# EAGLE design navscreen_piboard_r0 (EAGLE 6.5.0)
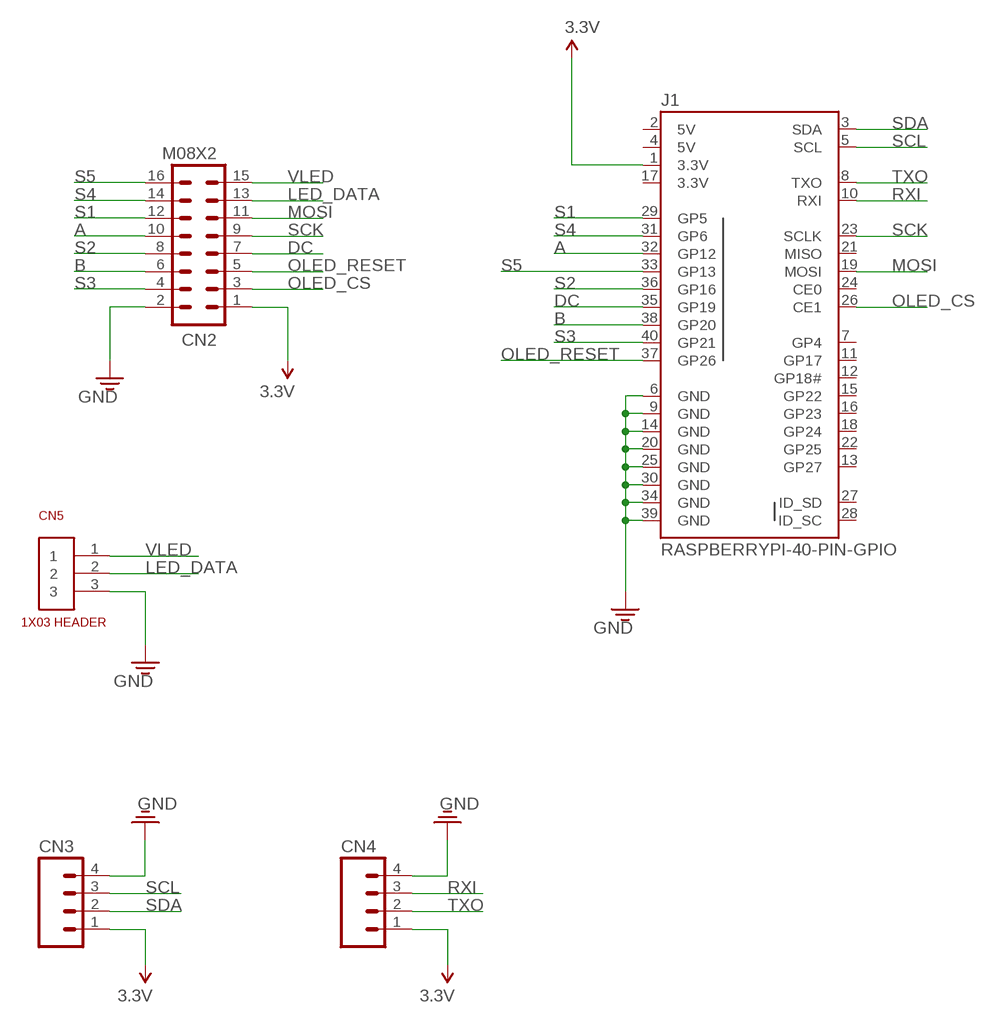
[diagram p0: schematic, sheet 1]

## Parts
CN2  M08X2  [2X8]
CN3  M04PTH  [1X04]
CN4  M04PTH  [1X04]
CN5  1X03  [1X03]
J1  RASPBERRYPI-40-PIN-GPIO  [2X20-SHROUDED]

## Nets
3.3V: CN2.1 CN3.1 CN4.1 J1.1(3.3V)
A: CN2.10 J1.32(GP12)
B: CN2.6 J1.38(GP20)
DC: CN2.7 J1.35(GP19)
GND: CN2.2 CN3.4 CN4.4 CN5.3 J1.6(GND) J1.9(GND) J1.14(GND) J1.20(GND) J1.25(GND) J1.30(GND) J1.34(GND) J1.39(GND)
LED_DATA: CN2.13 CN5.2
MOSI: CN2.11 J1.19(MOSI)
OLED_CS: CN2.3 J1.26(CE1)
OLED_RESET: CN2.5 J1.37(GP26)
RXI: CN4.3 J1.10(RXI)
S1: CN2.12 J1.29(GP5)
S2: CN2.8 J1.36(GP16)
S3: CN2.4 J1.40(GP21)
S4: CN2.14 J1.31(GP6)
S5: CN2.16 J1.33(GP13)
SCK: CN2.9 J1.23(SCLK)
SCL: CN3.3 J1.5(SCL)
SDA: CN3.2 J1.3(SDA)
TXO: CN4.2 J1.8(TXO)
VLED: CN2.15 CN5.1
Unconnected: J1.7(GP4) J1.11(GP17) J1.12(GP18#) J1.13(GP27) J1.15(GP22) J1.16(GP23) J1.18(GP24) J1.21(MISO) J1.22(GP25) J1.24(CE0) J1.27(ID_SD) J1.28(ID_SC)

## Power pins joined to a net without a drawn wire
3.3V: J1.17(3.3V)
VLED: J1.2(5V) J1.4(5V)

## Library data of the parts
CN2 = SparkFun-Connectors:M08X2: .1" headers, two rows of 8 each
CN3 CN4 = SparkFun-Connectors:M04: Header 4 Standard 4-pin 0.1" header. Use with straight break away headers (SKU : PRT-00116), right angle break away headers (PRT-00553), swiss pins (PRT-00743), machine pins (PRT-00117), and female headers (PRT-00115). Molex polarized connector foot print use with SKU : PRT-08231 with associated crimp pins and housings. 1MM SMD Version SKU: PRT-10208
CN5 = openct:1X03
J1 = SparkFun-Boards:RASPBERRYPI-40-PIN-GPIO: Second Generation Raspberry Pi GPIO Header 2x20 pin connector, as found on B, B+, A+ models.

## Board
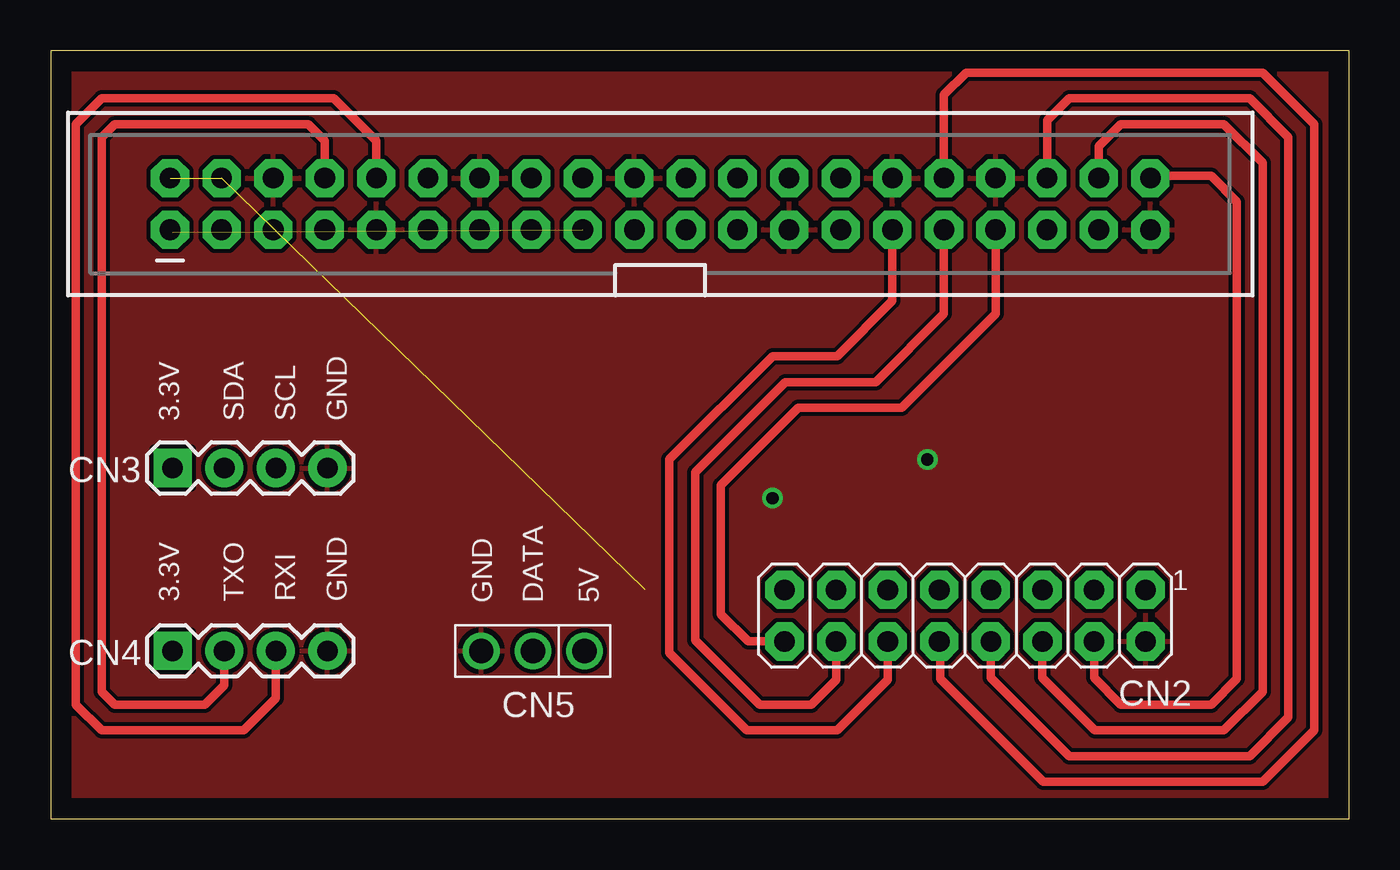
[diagram p1: board, top side]
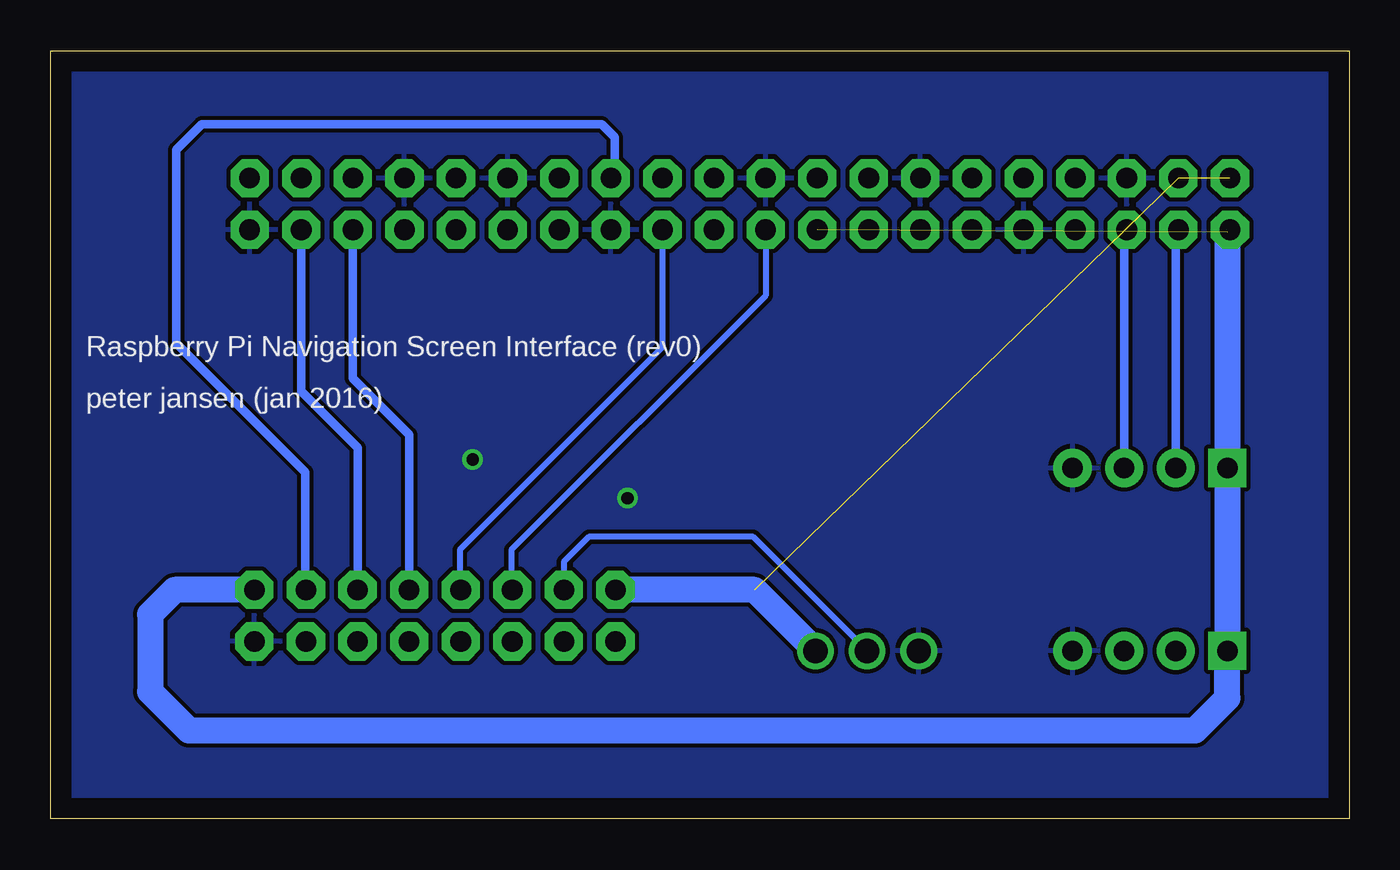
[diagram p2: board, bottom side, seen from below]

Size 63.92 x 37.81 mm. Coordinates in mm from the lower left corner, seen from the top.
Outline: 0,0 63.92,0 63.92,37.81 0,37.81 0,0
Copper layers (1*16): Top 0.035mm / dielectric 1.5mm / Bottom 0.035mm
Design rules "default": minimum track width 10mil, minimum drill 24mil, track to track 8mil, track to pad 8mil, pad to pad 8mil, via to via 8mil, smd to smd 8mil, copper to edge 40mil, drill to drill 8mil, minimum pad ring 10mil, minimum via ring 8mil, stop-mask expansion 4mil, vias tented up to drill 0mil, thermal gap 10mil

### Footprints (pad centres in the part's own frame; a part is rotated, then mirrored left to right if it is on the bottom)
2X8 = drill 1.016 pad 1.88 octagon: 1 0,0; 2 0,2.54; 3 2.54,0; 4 2.54,2.54; 5 5.08,0; 6 5.08,2.54; 7 7.62,0; 8 7.62,2.54; 9 10.16,0; 10 10.16,2.54; 11 12.7,0; 12 12.7,2.54; 13 15.24,0; 14 15.24,2.54; 15 17.78,0; 16 17.78,2.54
1X04 = drill 1.016 pad 1.88 square: 1 0,0 | drill 1.016 pad 1.88: 2 2.54,0; 3 5.08,0; 4 7.62,0
1X03 = drill 1.2: 1 -2.54,0; 2 0,0; 3 2.54,0
2X20-SHROUDED = drill 1.016 pad 1.88 octagon: 1 -1.27,24.13; 2 1.27,24.13; 3 -1.27,21.59; 4 1.27,21.59; 5 -1.27,19.05; 6 1.27,19.05; 7 -1.27,16.51; 8 1.27,16.51; 9 -1.27,13.97; 10 1.27,13.97; 11 -1.27,11.43; 12 1.27,11.43; 13 -1.27,8.89; 14 1.27,8.89; 15 -1.27,6.35; 16 1.27,6.35; 17 -1.27,3.81; 18 1.27,3.81; 19 -1.27,1.27; 20 1.27,1.27; 21 -1.27,-1.27; 22 1.27,-1.27; 23 -1.27,-3.81; 24 1.27,-3.81; 25 -1.27,-6.35; 26 1.27,-6.35; 27 -1.27,-8.89; 28 1.27,-8.89; 29 -1.27,-11.43; 30 1.27,-11.43; 31 -1.27,-13.97; 32 1.27,-13.97; 33 -1.27,-16.51; 34 1.27,-16.51; 35 -1.27,-19.05; 36 1.27,-19.05; 37 -1.27,-21.59; 38 1.27,-21.59; 39 -1.27,-24.13; 40 1.27,-24.13

### Placement (x,y rotation side)
CN2  53.9,11.27 180 top
CN3  6,17.27 0 top
CN4  6,8.27 0 top
CN5  23.73,8.27 180 top
J1  30,30.27 90 top

### Tracks (layer width: path | path; a pad name or v marks a point on that pad's centre or on a via)
3.3V  (1 unrouted)
  Bottom 1.016: J1.1 6,28.87
  Bottom 1.27: CN2.1 57.83,11.27 59.03,10.07 59.03,6.26 57.12,4.36 7.59,4.36 6,5.95 CN4.1 CN3.1 6,28.87
A
  Top 0.406: CN2.10 43.78,8.69 43.78,6.9 48.87,1.82 59.66,1.82 62.2,4.36 62.2,34.2 59.66,36.74 45.05,36.74 43.97,35.66 J1.32
B
  Top 0.406: CN2.6 48.82,6.94 51.41,4.36 57.75,4.36 59.66,6.26 59.66,32.3 57.75,34.2 52.67,34.2 51.59,33.12 J1.38
DC
  Bottom 0.406: CN2.7 46.28,18.92 49.05,21.69 J1.35
GND  (via drill 0.6)
  other vias: 43.15,17.69 35.53,15.79
  pour Bottom: -0.03,38.01 -0.03,-0.09 64.11,-0.09 64.11,38.01
  pour Top: -0.03,38.01 -0.03,-0.09 64.11,-0.09 64.11,38.01
LED_DATA
  Bottom 0.305: CN5.2 29.34,13.88 37.44,13.88 38.66,12.66 CN2.13
MOSI
  Bottom 0.305: J1.19 28.73,25.76 41.24,13.25 41.24,11.32 CN2.11
OLED_CS
  Bottom 0.406: J1.26 36.16,31.73 36.16,33.57 36.8,34.2 56.48,34.2 57.75,32.93 57.75,23.41 51.41,17.05 51.41,11.32 CN2.3
OLED_RESET
  Bottom 0.406: CN2.5 48.82,18.28 51.59,21.05 J1.37
RXI
  Top 0.406: J1.10 16.03,33.38 13.94,35.47 2.51,35.47 1.24,34.2 1.24,5.62 2.51,4.36 9.5,4.36 11.08,5.94 CN4.3
S1
  Top 0.406: CN2.12 41.2,6.85 38.7,4.36 34.26,4.36 30.45,8.17 30.45,17.69 35.53,22.77 38.7,22.77 41.43,25.49 J1.29
S2
  Top 0.406: CN2.8 46.28,6.94 50.14,3.09 59.03,3.09 60.93,4.99 60.93,33.57 59.03,35.47 50.14,35.47 49.05,34.38 J1.36
S3
  Top 0.406: CN2.4 51.36,6.94 52.67,5.62 57.12,5.62 58.39,6.9 58.39,30.39 57.12,31.66 54.25,31.66 J1.40
S4
  Top 0.406: CN2.14 38.66,6.85 37.44,5.62 34.9,5.62 31.72,8.8 31.72,17.05 36.16,21.5 40.61,21.5 43.97,24.86 J1.31
S5
  Top 0.406: CN2.16 34.33,8.73 32.99,10.07 32.99,16.42 36.8,20.23 41.88,20.23 46.51,24.86 J1.33
SCK
  Bottom 0.305: J1.23 33.81,23.22 43.78,13.25 43.78,11.32 CN2.9
SCL
  Bottom 0.406: J1.5 11.08,28.87 CN3.3
SDA
  Bottom 0.406: J1.3 8.54,28.87 CN3.2
TXO
  Top 0.406: J1.8 13.49,33.38 12.67,34.2 3.14,34.2 2.51,33.57 2.51,6.26 3.14,5.62 7.59,5.62 8.54,6.58 CN4.2
VLED  (2 unrouted)
  Bottom 1.27: CN5.1 29.27,11.27 CN2.15

### Text on the board
tPlace: 3.3V | SDA | SCL | GND | 1 | 3.3V | TXO | RXI | GND | GND | DATA | 5V | CN5
bPlace: Raspberry Pi Navigation Screen Interface (rev0) | peter jansen (jan 2016)